# Altium project Probe.PrjPCB
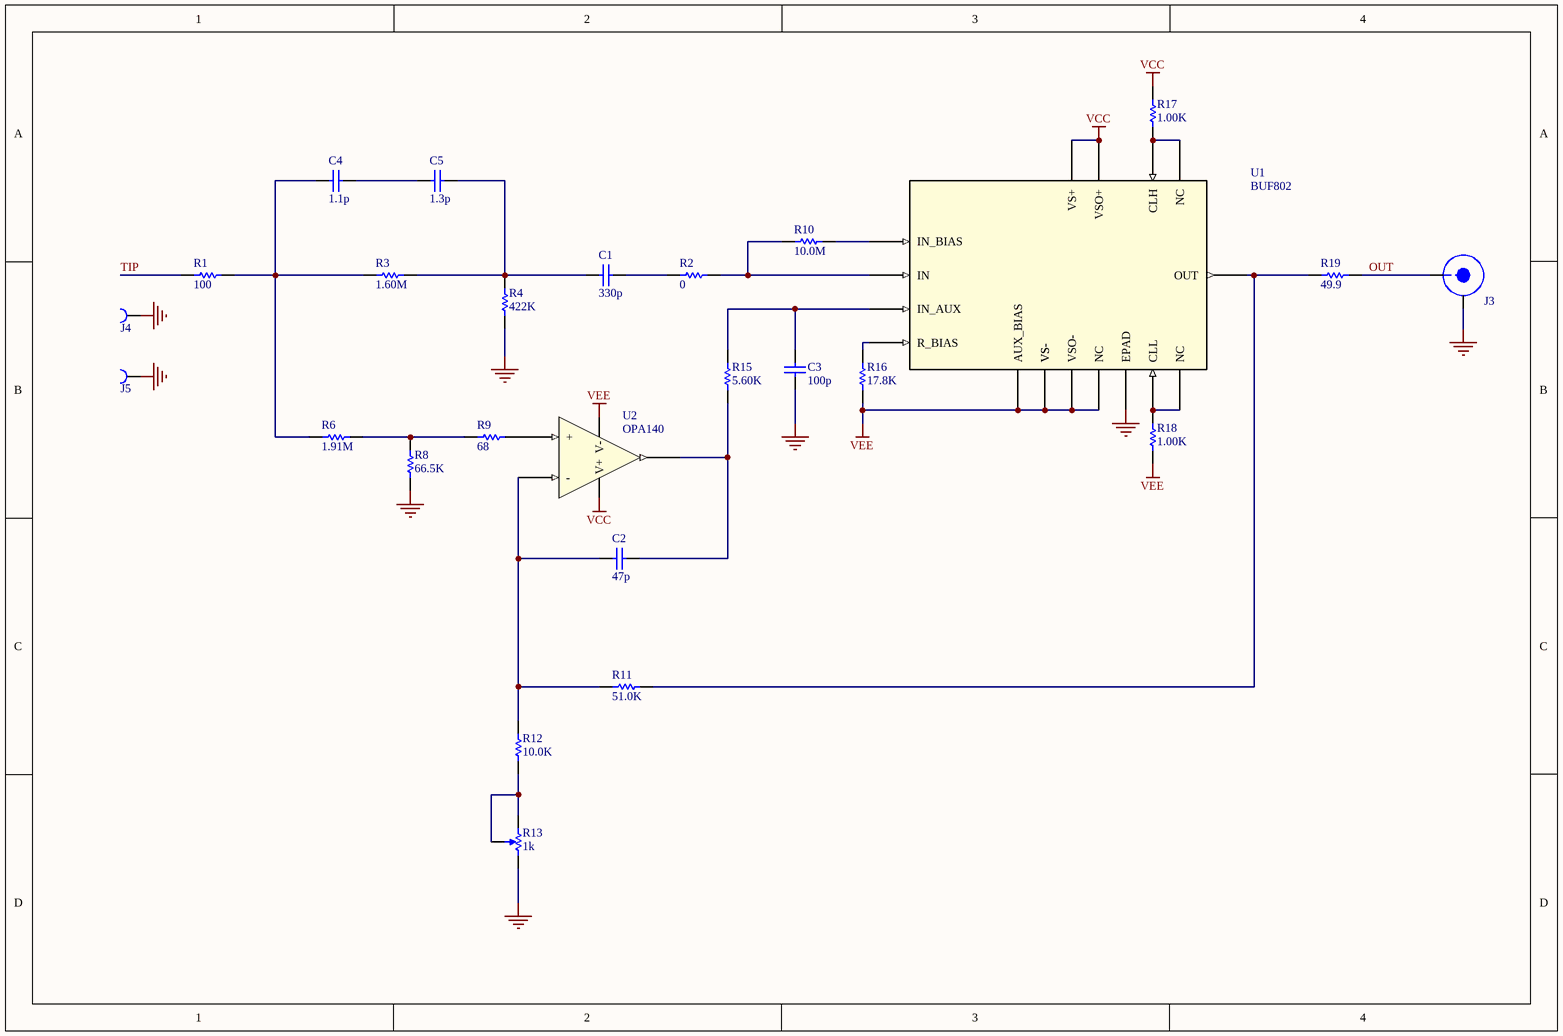
[diagram p0: Probe.SchDoc]
2 sheets, 62 parts. Net scope: global (net labels, ports and power ports of the same name join across sheets).
Board file: Probe.PcbDoc
Sheets:
  Probe.SchDoc
  Power.SchDoc

## Sheet Probe.SchDoc: Active probe evaluation board
size A4

### Parts
C1  330p  [CAPC0402(1005)50_M]
C2  47p  [CAPC0402(1005)50_M]
C3  100p  [CAPC0402(1005)50_M]
C4  1.1p  [CAPC0402(1005)50_M]
C5  1.3p  [CAPC0402(1005)50_M]
J3  BWSMA-KE-P001  [BATWIRELESS_BWSMA-KE-P001]  (value not drawn)
J4  0339-0-15-01-15-27-10-0  [MILL-MAX 0339]  (value not drawn)
J5  0339-0-15-01-15-27-10-0  [MILL-MAX 0339]  (value not drawn)
R1  100  [RESC0402(1005)_M]
R2  0  [RESC0402(1005)_M]
R3  1.60M  [RESC0402(1005)_M]
R4  422K  [RESC0402(1005)_M]
R6  1.91M  [RESC0402(1005)_M]
R8  66.5K  [RESC0402(1005)_M]
R9  68  [RESC0402(1005)_M]
R10  10.0M  [RESC0402(1005)_M]
R11  51.0K  [RESC0402(1005)_M]
R12  10.0K  [RESC0402(1005)_M]
R13  1k  [PVG3A]
R15  5.60K  [RESC0402(1005)_M]
R16  17.8K  [RESC0402(1005)_M]
R17  1.00K  [RESC0402(1005)_M]
R18  1.00K  [RESC0402(1005)_M]
R19  49.9  [RESC0402(1005)_M]
U1  BUF802  [VQFN16_RGT_TEX- OSHPARK]
U2  OPA140  [SOIC-8]

### Nets
GND: C3.2 J3.2 J4.1 J5.1 R4.2 R8.2 R13.3 U1.17(EPAD)
VCC: R17.2 U1.1(VS+) U1.12(VSO+) U2.7(V+)
VEE: R16.2 R18.2 U1.5(VS-) U1.6(AUX_BIAS) U1.8(VS-) U1.9(NC) U1.10(VSO-) U2.4(V-)
OUT: J3.1 R19.2
TIP: R1.1
NetC1_1: C1.1 C5.2 R3.2 R4.1
NetC1_2: C1.2 R2.1
NetC2_1: C2.1 R11.1 R12.1 U2.2(-)
NetC2_2: C2.2 R15.2 U2.6(OUT)
NetC3_1: C3.1 R15.1 U1.4(IN_AUX)
NetC4_1: C4.1 R1.2 R3.1 R6.1
NetC4_2: C4.2 C5.1
NetR2_2: R2.2 R10.1 U1.2(IN)
NetR6_2: R6.2 R8.1 R9.1
NetR9_2: R9.2 U2.3(+)
NetR10_2: R10.2 U1.3(IN_BIAS)
NetR11_2: R11.2 R19.1 U1.11(OUT)
NetR12_2: R12.2 R13.1 R13.2
NetR16_1: R16.1 U1.7(R_BIAS)
NetR17_1: R17.1 U1.15(CLH) U1.16(NC)
NetR18_1: R18.1 U1.13(NC) U1.14(CLL)

### Notes on the sheet
- Title
- Size:
- Date:
- A4
- Number:
- Time:
- Revision:
- Sheet
- of
- File:

### Library data of the parts
C1 = GRM1555C1H331JA01: CAP CER 330PF±5% 50V C0G 0402; Manufacturer: Murata; Manufacturer Part Number: GRM1555C1H331JA01D; Capacitance: 330pF; Tolerance: ±5%; Value: 330p; Temperature Coefficient: C0G; Part Number: GRM1555C1H331JA01
C2 = CL05C470JB5NNN: CAP CER 47PF±5% 50V C0G 0402; Manufacturer: Samsung Electro-Mechanics; Manufacturer Part Number: CL05C470JB5NNNC; Capacitance: 47pF; Tolerance: ±5%; Voltage Rating: 50V; Temperature Coefficient: C0G; Part Number: CL05C470JB5NNN; Value: 47p
C3 = CL05C101JB5NNN: CAP CER 100PF±5% 50V C0G 0402; Manufacturer: Samsung Electro-Mechanics; Manufacturer Part Number: CL05C101JB5NNNC; Capacitance: 100pF; Tolerance: ±5%; Voltage Rating: 50V; Temperature Coefficient: C0G; Part Number: CL05C101JB5NNN; Value: 100p
C4 = GJM1555C1H1R1WB01: CAP CER 1.1PF±0.05PF 50V C0G/NP0 0402; Manufacturer: Murata; Manufacturer Part Number: GJM1555C1H1R1WB01D; Capacitance: 1.1pF; Tolerance: ±0.05pF; Temperature Coefficient: C0G; Part Number: GJM1555C1H1R1WB01; Value: 1.1p
C5 = GJM1555C1H1R3WB01: CAP CER 1.3PF±0.05PF 50V C0G/NP0 0402; Manufacturer: Murata; Manufacturer Part Number: GJM1555C1H1R3WB01D; Capacitance: 1.3pF; Tolerance: ±0.05pF; Temperature Coefficient: C0G; Part Number: GJM1555C1H1R3WB01; Value: 1.3p
J3 = 901-10511-3: CONN SMA JACK STR 50OHM EDGE MNT; Manufacturer: BAT WIRELESS; Impedance: 50R; Max Frequency: 26.5GHz; Voltage Rating: 170V; Supplier 1: Digi-Key; Manufacturer PartN: BWSMA-KE-P001; Case/Package: SMA; Contact Material: Copper; Min Operating Temperature: -65°C; Max Operating Temperature: 165°C; Connector Type: SMA; Series: -; Packaging: Bulk; Termination: Solder; ComponentLink1URL: https://datasheet.octopart.com/901-10511-3-Amphenol-RF-datasheet-67291285.pdf?src-supplier=Element14; ComponentLink1Description: https://datasheet.octopart.com/901-10511-3-Amphenol-RF-datasheet-67291285.pdf?src-supplier=Element14; Supplier 2: Mouser; Supplier Part Number 2: 523-901-10511-3; Supplier Part Number 1: ARF2500-ND; Mount: Edge,Board; RoHS Compliant: Yes; ComponentLink2URL: https://datasheet.octopart.com/901-10511-3-Amphenol-RF-datasheet-67291280.pdf?src-supplier=Newark; ComponentLink2Description: https://datasheet.octopart.com/901-10511-3-Amphenol-RF-datasheet-67291280.pdf?src-supplier=Newark; ComponentLink3URL: http://www.amphenolrf.com/media/downloads/7776/C901-10511-3.pdf?src-supplier=Digi-Key; ComponentLink3Description: http://www.amphenolrf.com/media/downloads/7776/C901-10511-3.pdf?src-supplier=Digi-Key; Distributor: LCSC; Distributor PartN: C496550
J4 J5 = 0339-0-15-01-15-27-10-0: CONN PIN RCPT; Manufacturer: TE Connectivity; Manufacturer PartN: 50935-6; Parameters: Spring Socket; Value: 50935-6; Distributor: LCSC; Distributor PartN: C5439457
R1 = RESC0402-100R-1pct: RES 100 OHM 1% 1/16W 0402; Manufacturer 1: Yageo; Manufacturer Part Number 1: RC0402FR-07100RL; Part Number: RESC0402-100R-1pct; Ohms: 100; Value: 100; Manufacturer 2: Stackpole Electronics; Manufacturer Part Number 2: RMCF0402FT100R; Manufacturer 3: Vishay Dale; Manufacturer Part Number 3: CRCW0402100RFKED; Manufacturer 4: Panasonic Electronic Components; Manufacturer Part Number 4: ERJ-2RKF1000X
R2 = R0402-0R0-JMP: RES 0 OHM JUMPER 0402; Manufacturer 1: Yageo; Manufacturer Part Number 1: RC0402FR-071RL; Part Number: R0402-0R0-JMP; Ohms: 0; Value: 0; Manufacturer 2: Stackpole Electronics; Manufacturer Part Number 2: RMCF0402FT1R00; Manufacturer 3: Vishay Dale; Manufacturer Part Number 3: CRCW04021R00FNED; Manufacturer 4: Panasonic Electronic Components; Manufacturer Part Number 4: ERJ-2GE0R00X
R3 = RESC0402-1M60-1pct: RES 1.60M OHM 1% 1/16W 0402; Manufacturer 1: Yageo; Manufacturer Part Number 1: RC0402FR-071M6L; Ohms: 1600000; Part Number: RESC0402-1M60-1pct; Value: 1.60M; Manufacturer 2: Stackpole Electronics; Manufacturer Part Number 2: RMCF0402FT1M60; Manufacturer 3: Vishay Dale; Manufacturer Part Number 3: CRCW04021M60FKED; Manufacturer 4: Panasonic Electronic Components
R4 = RESC0402-422K-1pct: RES 422K OHM 1% 1/16W 0402; Manufacturer 1: Yageo; Manufacturer Part Number 1: RC0402FR-07422KL; Ohms: 422000; Part Number: RESC0402-422K-1pct; Value: 422K; Manufacturer 2: Stackpole Electronics; Manufacturer Part Number 2: RMCF0402FT422K; Manufacturer 3: Vishay Dale; Manufacturer Part Number 3: CRCW0402422KFKED; Manufacturer 4: Panasonic Electronic Components; Manufacturer Part Number 4: ERJ-2RKF4223X
R6 = RESC0402-1M91-1pct: RES 1.91M OHM 1% 1/16W 0402; Manufacturer 1: Yageo; Manufacturer Part Number 1: RC0402FR-071M91L; Ohms: 1910000; Part Number: RESC0402-1M91-1pct; Value: 1.91M; Manufacturer 2: Stackpole Electronics; Manufacturer Part Number 2: RMCF0402FT1M91; Manufacturer 3: Vishay Dale; Manufacturer Part Number 3: CRCW04021M91FKED; Manufacturer 4: Panasonic Electronic Components
R8 = RESC0402-66K5-1pct: RES 66.5K OHM 1% 1/16W 0402; Manufacturer 1: Yageo; Manufacturer Part Number 1: RC0402FR-0766K5L; Ohms: 66500; Part Number: RESC0402-66K5-1pct; Value: 66.5K; Manufacturer 2: Stackpole Electronics; Manufacturer Part Number 2: RMCF0402FT66K5; Manufacturer 3: Vishay Dale; Manufacturer Part Number 3: CRCW040266K5FKED; Manufacturer 4: Panasonic Electronic Components; Manufacturer Part Number 4: ERJ-2RKF6652X
R9 = RESC0402-68R0-1pct: RES 68 OHM 1% 1/16W 0402; Manufacturer 1: Yageo; Manufacturer Part Number 1: RC0402FR-0768RL; Part Number: RESC0402-68R0-1pct; Ohms: 68; Value: 68; Manufacturer 2: Stackpole Electronics; Manufacturer Part Number 2: RMCF0402FT68R0; Manufacturer 3: Vishay Dale; Manufacturer Part Number 3: CRCW040268R0FKED; Manufacturer 4: Panasonic Electronic Components; Manufacturer Part Number 4: ERJ-2RKF68R0X
R10 = RESC0402-10M0-1pct: RES 10.0M OHM 1% 1/16W 0402; Manufacturer 1: Yageo; Manufacturer Part Number 1: RC0402FR-0710ML; Ohms: 10000000; Part Number: RESC0402-10M0-1pct; Value: 10.0M; Manufacturer 2: Stackpole Electronics; Manufacturer Part Number 2: RMCF0402FT10M0; Manufacturer 3: Vishay Dale; Manufacturer Part Number 3: CRCW040210M0FKED; Manufacturer 4: Panasonic Electronic Components
R11 = RESC0402-51K0-1pct: RES 51.0K OHM 1% 1/16W 0402; Manufacturer 1: Yageo; Manufacturer Part Number 1: RC0402FR-0751KL; Ohms: 51000; Part Number: RESC0402-51K0-1pct; Value: 51.0K; Manufacturer 2: Stackpole Electronics; Manufacturer Part Number 2: RMCF0402FT51K0; Manufacturer 3: Vishay Dale; Manufacturer Part Number 3: CRCW040251K0FKED; Manufacturer 4: Panasonic Electronic Components; Manufacturer Part Number 4: ERJ-2RKF5102X
R12 = RESC0402-10K0-1pct: RES 10.0K OHM 1% 1/16W 0402; Manufacturer 1: Yageo; Manufacturer Part Number 1: RC0402FR-0710KL; Ohms: 10000; Part Number: RESC0402-10K0-1pct; Value: 10.0K; Manufacturer 2: Stackpole Electronics; Manufacturer Part Number 2: RMCF0402FT10K0; Manufacturer 3: Vishay Dale; Manufacturer Part Number 3: CRCW040210K0FKED; Manufacturer 4: Panasonic Electronic Components; Manufacturer Part Number 4: ERJ-2RKF1002X
R13 = PVG3A102C01R00: TRIMMER 1K OHM 0.25W J LEAD TOP; Manufacturer: Bourns; Resistance: 1kR; Number of Turns: 1; Max Power Dissipation: 250mW; Tolerance: 20%; Temperature Coefficient: 150ppm/°C; Supplier 1: Digi-Key; Supplier Part Number 1: 490-2643-6-ND; Manufacturer Part Number: PVG3A102C01R00; Stock 1: 4867; Pricing 1: 1=1.44, 10=1.273, 25=1.1452, 50=1.103, 100=1.0605, 250=0.99688, 500=0.8484 (USD); Mount: Surface Mount; Packaging: Cut Tape; Resistor Type: Cermet; Height: 0.079inch; ComponentLink1URL: https://datasheet.octopart.com/PVG3A102C01R00-Bourns-datasheet-154729832.pdf?src-supplier=Newark; ComponentLink1Description: https://datasheet.octopart.com/PVG3A102C01R00-Bourns-datasheet-154729832.pdf?src-supplier=Newark; ComponentLink2URL: https://datasheet.octopart.com/PVG3A102C01R00-Bourns-datasheet-82548162.pdf?src-supplier=Element14; ComponentLink2Description: https://datasheet.octopart.com/PVG3A102C01R00-Bourns-datasheet-82548162.pdf?src-supplier=Element14; ComponentLink3URL: https://www.bourns.com/docs/Product-Datasheets/pvg3.pdf?src-supplier=Digi-Key; ComponentLink3Description: https://www.bourns.com/docs/Product-Datasheets/pvg3.pdf?src-supplier=Digi-Key; ComponentLink4URL: http://www.bourns.com/docs/Product-Datasheets/pvg3.pdf?src-supplier=Digi-Key; ComponentLink4Description: http://www.bourns.com/docs/Product-Datasheets/pvg3.pdf?src-supplier=Digi-Key; ComponentLink5URL: https://www.mouser.com/ds/2/54/vg3-1084610.pdf?src-supplier=Mouser; ComponentLink5Description: https://www.mouser.com/ds/2/54/vg3-1084610.pdf?src-supplier=Mouser; Supplier 2: Mouser; Supplier Part Number 2: 81-PVG3A102C01R00
R15 = RESC0402-5K60-1pct: RES 5.60K OHM 1% 1/16W 0402; Manufacturer 1: Yageo; Manufacturer Part Number 1: RC0402FR-075K6L; Ohms: 5600; Part Number: RESC0402-5K60-1pct; Value: 5.60K; Manufacturer 2: Stackpole Electronics; Manufacturer Part Number 2: RMCF0402FT5K60; Manufacturer 3: Vishay Dale; Manufacturer Part Number 3: CRCW04025K60FKED; Manufacturer 4: Panasonic Electronic Components; Manufacturer Part Number 4: ERJ-2RKF5601X
R16 = RESC0402-17K8-1pct: RES 17.8K OHM 1% 1/16W 0402; Manufacturer 1: Yageo; Manufacturer Part Number 1: RC0402FR-0717K8L; Ohms: 17800; Part Number: RESC0402-17K8-1pct; Value: 17.8K; Manufacturer 2: Stackpole Electronics; Manufacturer Part Number 2: RMCF0402FT17K8; Manufacturer 3: Vishay Dale; Manufacturer Part Number 3: CRCW040217K8FKED; Manufacturer 4: Panasonic Electronic Components; Manufacturer Part Number 4: ERJ-2RKF1782X
R17 R18 = RESC0402-1K00-1pct: RES 1.00K OHM 1% 1/16W 0402; Manufacturer 1: Yageo; Manufacturer Part Number 1: RC0402FR-071KL; Ohms: 1000; Part Number: RESC0402-1K00-1pct; Value: 1.00K; Manufacturer 2: Stackpole Electronics; Manufacturer Part Number 2: RMCF0402FT1K00; Manufacturer 3: Vishay Dale; Manufacturer Part Number 3: CRCW04021K00FKED; Manufacturer 4: Panasonic Electronic Components; Manufacturer Part Number 4: ERJ-2RKF1001X
R19 = RESC0402-49R9-1pct: RES 49.9 OHM 1% 1/16W 0402; Manufacturer 1: Yageo; Manufacturer Part Number 1: RC0402FR-0749R9L; Part Number: RESC0402-49R9-1pct; Ohms: 49.9; Value: 49.9; Manufacturer 2: Stackpole Electronics; Manufacturer Part Number 2: RMCF0402FT49R9; Manufacturer 3: Vishay Dale; Manufacturer Part Number 3: CRCW040249R9FKED; Manufacturer 4: Panasonic Electronic Components; Manufacturer Part Number 4: ERJ-2RKF49R9X
U1 = BUF802IRGTR: WIDE-BANDWIDTH JFET BUFFER; Manufacturer: Texas Instruments; Supplier 1: Digi-Key; Manufacturer Part Number: BUF802IRGTR; Stock 1: 1253; Pricing 1: 1=5.06, 10=4.541, 25=4.2928, 100=3.7206, 250=3.5298, 500=3.16728, 1000=2.88 (USD); Supplier 2: Mouser; Supplier Part Number 1: 296-BUF802IRGTRCT-ND; Supplier Part Number 2: 595-BUF802IRGTR
U2 = OPA140AIDR: IC OPAMP JFET 1 CIRCUIT 8SOIC; Manufacturer: Texas Instruments; Slew Rate: 20V/µs; Output Current per Channel: 36mA; Number of Circuits: 1; Gain Bandwidth Product: 11MHz; Input Bias Current: 10pA; Input Offset Voltage (Vos): 30uV; Operating Supply Current: 1.8mA; Min Dual Supply Voltage: 2.25V; Max Dual Supply Voltage: 18V; Max Supply Voltage: 36V; Min Supply Voltage: 4.5V; Nominal Supply Current: 2mA; Voltage Gain: 126dB; Max I/O Voltage: 120uV; Power Supply Rejection Ratio (PSRR): 140dB; Supplier 1: Digi-Key; Manufacturer Part Number: OPA140AIDR; Stock 1: 3434; Pricing 1: 1=4.01, 10=3.606, 25=3.4088, 100=2.9542, 250=2.80276, 500=2.5149, 1000=2.121 (USD); Number of Pins: 8; Min Operating Temperature: -40°C; Max Operating Temperature: 125°C; Series: -; Packaging: Tape and Reel; RoHS Compliant: Yes; ComponentLink1URL: https://datasheet.ciiva.com/14459/sbos498a-14459066.pdf?src-supplier=Avnet; ComponentLink1Description: https://datasheet.ciiva.com/14459/sbos498a-14459066.pdf?src-supplier=Avnet; Supplier 2: Mouser; Supplier Part Number 1: 296-43606-6-ND; Supplier Part Number 2: 595-OPA140AIDR; Case/Package: D; Contact Plating: Gold; Package Quantity: 2500; Number of Elements: 1; Output Current: 36mA; Unity Gain Bandwidth Product: 11MHz; Common Mode Rejection Ratio: 126dB; Nominal Gain Bandwidth Product: 11MHz; Number of Channels: 1; Operating Supply Voltage: 18V; Supply Current: 2mA; Technology: BIFET; Radiation Hardening: No; Lead Free: Lead Free; ComponentLink2URL: https://datasheet.ciiva.com/1815/opa140-1815515.pdf?src-supplier=Digi-Key; ComponentLink2Description: https://datasheet.ciiva.com/1815/opa140-1815515.pdf?src-supplier=Digi-Key

## Sheet Power.SchDoc
size A4
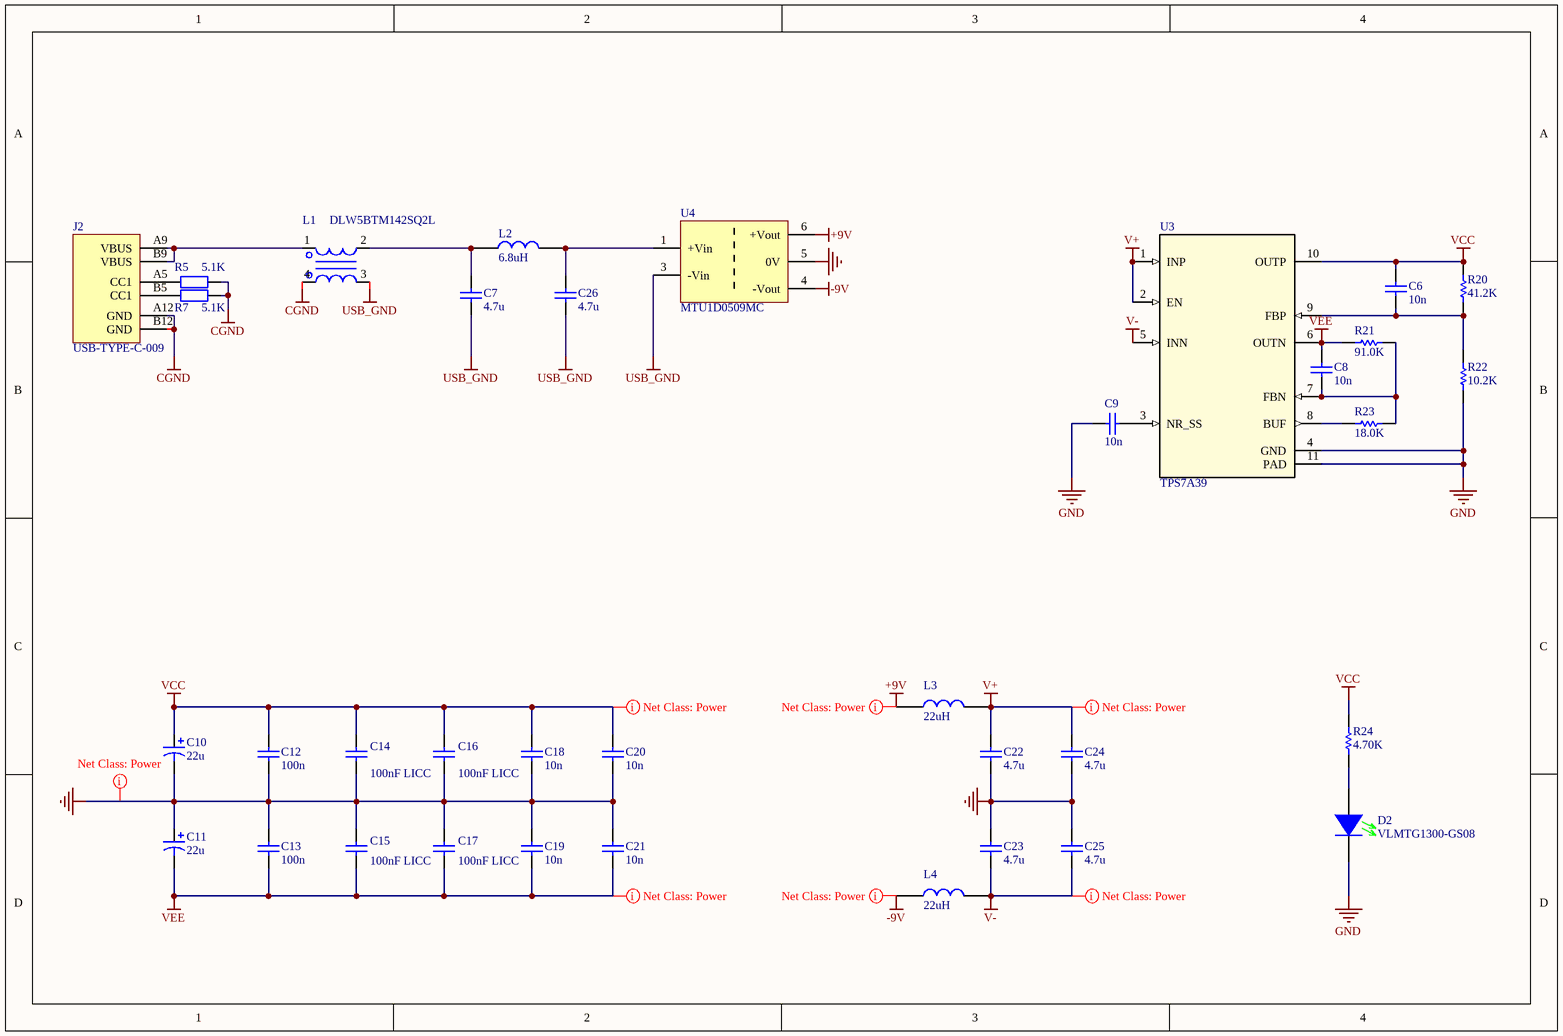
[diagram p1: Power.SchDoc]

### Parts
C6  10n  [CAPC0402(1005)50_M]
C7  4.7u  [CAPC0805(2012)100_M]
C8  10n  [CAPC0402(1005)50_M]
C9  10n  [CAPC0402(1005)50_M]
C10  22u  [KEMET B_M]
C11  22u  [KEMET B_M]
C12  100n  [CAPC0603(1608)100_M]
C13  100n  [CAPC0603(1608)100_M]
C14  value 100nF LICC  [CAPC0306_M]  (hidden comment: 100n LICC)
C15  value 100nF LICC  [CAPC0306_M]  (hidden comment: 100n LICC)
C16  value 100nF LICC  [CAPC0306_M]  (hidden comment: 100n LICC)
C17  value 100nF LICC  [CAPC0306_M]  (hidden comment: 100n LICC)
C18  10n  [CAPC0402(1005)50_M]
C19  10n  [CAPC0402(1005)50_M]
C20  10n  [CAPC0402(1005)50_M]
C21  10n  [CAPC0402(1005)50_M]
C22  4.7u  [CAPC0805(2012)100_M]
C23  4.7u  [CAPC0805(2012)100_M]
C24  4.7u  [CAPC0805(2012)100_M]
C25  4.7u  [CAPC0805(2012)100_M]
C26  4.7u  [CAPC0805(2012)100_M]
D2  VLMTG1300-GS08  [LED0603(1608)_M]
J2  value USB-TYPE-C-009  [GCT_USB4125-GF-A_REVA2]  (hidden comment: USB- C)
L1  value DLW5BTM142SQ2L  [SDCW3225]  (hidden comment: Choke)
L2  value 6.8uH  [SML-1210]  (hidden comment: Inductor)
L3  value 22uH  [SML-1210]  (hidden comment: Inductor)
L4  value 22uH  [SML-1210]  (hidden comment: Inductor)
R5  value 5.1K  [SMR-0402]  (hidden comment: Res)
R7  value 5.1K  [SMR-0402]  (hidden comment: Res)
R20  41.2K  [RESC0402(1005)_M]
R21  91.0K  [RESC0402(1005)_M]
R22  10.2K  [RESC0402(1005)_M]
R23  18.0K  [RESC0402(1005)_M]
R24  4.70K  [RESC0603(1608)_M]
U3  TPS7A39  [DSC0010J_NV]
U4  MTU1D0509MC  [MTU1D0509MC]

### Nets
+9V: L3.1 U4.6(+Vout)
-9V: L4.1 U4.4(-Vout)
CGND: J2.A12(GND) J2.B12(GND) L1.4 R5.1 R7.1
GND: C9.2 C10.2 C11.1 C12.2 C13.1 C14.2 C15.1 C16.2 C17.1 C18.2 C19.1 C20.2 C21.1 C22.2 C23.1 C24.2 C25.2 D2.2(K) R22.2 U3.4(GND) U3.11(PAD) U4.5(0V)
USB_GND: C7.2 C26.2 L1.3 U4.3(-Vin)
V+: C22.1 C24.1 L3.2 U3.1(INP) U3.2(EN)
V-: C23.2 C25.1 L4.2 U3.5(INN)
VCC: C6.2 C10.1 C12.1 C14.1 C16.1 C18.1 C20.1 R20.1 R24.1 U3.10(OUTP)
VEE: C8.2 C11.2 C13.2 C15.2 C17.2 C19.2 C21.2 R21.2 U3.6(OUTN)
NetC6_1: C6.1 R20.2 R22.1 U3.9(FBP)
NetC7_1: C7.1 L1.2 L2.1
NetC8_1: C8.1 R21.1 R23.1 U3.7(FBN)
NetC9_1: C9.1 U3.3(NR_SS)
NetC26_1: C26.1 L2.2 U4.1(+Vin)
NetD2_1: D2.1(A) R24.2
NetJ2_A5: J2.A5(CC1) R5.2
NetJ2_A9: J2.A9(VBUS) J2.B9(VBUS) L1.1
NetJ2_B5: J2.B5(CC1) R7.2
NetR23_2: R23.2 U3.8(BUF)

### Layout directives
net class Power: +9V, -9V, GND, V+, V-, VCC, VEE

### Library data of the parts
C6 C8 C9 = GRM1555C1E103JE01: CAP CER 10NF±5% 25V C0G 0402; Manufacturer: Murata; Manufacturer Part Number: GRM1555C1E103JE01D; Tolerance: ±5%; Capacitance: 10nF; Part Number: GRM1555C1E103JE01; Value: 10n; Temperature Coefficient: C0G
C7 C22-C26 = GRM21BZ71H475KE15K: CAP CER 4.7UF 50V X7R 0805; Manufacturer: Murata; Supplier 1: Digi-Key; Manufacturer Part Number: GRM21BZ71H475KE15K; Stock 1: 134344; Pricing 1: 1=0.6, 10=0.444, 50=0.3554, 100=0.3047, 500=0.2412, 1000=0.20311, 2500=0.19042, 5000=0.17772 (USD); ComponentLink1URL: https://datasheet.octopart.com/GRM21BZ71H475KE15K-Murata-datasheet-149523520.pdf?src-supplier=Newark; ComponentLink1Description: https://datasheet.octopart.com/GRM21BZ71H475KE15K-Murata-datasheet-149523520.pdf?src-supplier=Newark; Supplier Part Number 1: 490-GRM21BZ71H475KE15KCT-ND; RoHS Compliant: Yes; ComponentLink2URL: https://datasheet.octopart.com/GRM21BZ71H475KE15K-Murata-datasheet-165579666.pdf?src-supplier=TME; ComponentLink2Description: https://datasheet.octopart.com/GRM21BZ71H475KE15K-Murata-datasheet-165579666.pdf?src-supplier=TME; Supplier 2: Mouser; Supplier Part Number 2: 81-GRM21BZ71H475KE5K
C10 C11 = T491B226K016AT: CAP TANT 22UF 10% 16V 1411; Manufacturer: KEMET; Dielectric Material: Tantalum; ESR (Equivalent Series Resistance): 2.2R; Polarity: Polar; Dissipation Factor: 6%; Life (Hours): 2000Hour; Leakage Current: 3.6uA; Ripple Current: 197mA; Supplier 1: Digikey; Supplier Part Number 1: 399-8312-6-ND; Manufacturer Part Number: T491B226K016AT; Stock 1: 3174; Pricing 1: 1=0.64, 10=0.433, 50=0.3444, 100=0.2844, 500=0.2222, 1000=0.18887 (USD); Mount: Surface Mount,PCB; Case/Package: 1411; Case Code (Imperial): 1411; Case Code (Metric): 3528; Min Operating Temperature: -55°C; Max Operating Temperature: 125°C; Capacitance: 22uF; Tolerance: 10%; Packaging: Tape and Reel; Construction: Flat; Voltage Rating: 16V; Series: T491; Termination: SMD/SMT; Package Quantity: 1; Voltage Rating (DC): 16V; Features: General Purpose; Voltage: 16V; Length: 3.5mm; Width: 2.8mm; Height: 1.9mm; Depth: 2.8mm; Height - Seated (Max): 0.083inch; Radiation Hardening: No; RoHS Compliant: Yes; Lead Free: Lead Free; Reach SVHC Compliant: Yes; ComponentLink1URL: https://datasheet.ciiva.com/8079/kem-t2005-t491-8079799.pdf?src-supplier=Element14; ComponentLink1Description: https://datasheet.ciiva.com/8079/kem-t2005-t491-8079799.pdf?src-supplier=Element14; ComponentLink2URL: https://datasheet.ciiva.com/7696/1854511-7696325.pdf?src-supplier=Element14; ComponentLink2Description: https://datasheet.ciiva.com/7696/1854511-7696325.pdf?src-supplier=Element14; ComponentLink3URL: https://datasheet.ciiva.com/7696/1446014-7696326.pdf?src-supplier=Element14; ComponentLink3Description: https://datasheet.ciiva.com/7696/1446014-7696326.pdf?src-supplier=Element14; ComponentLink4URL: https://datasheet.ciiva.com/5934/1446014-5934574.pdf?src-supplier=Farnell; ComponentLink4Description: https://datasheet.ciiva.com/5934/1446014-5934574.pdf?src-supplier=Farnell; ComponentLink5URL: https://datasheet.ciiva.com/6247/kem-t2005-t491-6247978.pdf?src-supplier=Digikey; ComponentLink5Description: https://datasheet.ciiva.com/6247/kem-t2005-t491-6247978.pdf?src-supplier=Digikey; ComponentLink6URL: https://datasheet.ciiva.com/6247/kem-t2005-t491-6247977.pdf?src-supplier=Digikey; ComponentLink6Description: https://datasheet.ciiva.com/6247/kem-t2005-t491-6247977.pdf?src-supplier=Digikey; ComponentLink7URL: https://datasheet.ciiva.com/6247/kem-t2005-t491-6247979.pdf?src-supplier=Digikey; ComponentLink7Description: https://datasheet.ciiva.com/6247/kem-t2005-t491-6247979.pdf?src-supplier=Digikey; ComponentLink8URL: https://datasheet.ciiva.com/14589/70095774-14589317.pdf?src-supplier=Allied+Electronics; ComponentLink8Description: https://datasheet.ciiva.com/14589/70095774-14589317.pdf?src-supplier=Allied+Electronics; ComponentLink9URL: https://datasheet.ciiva.com/14600/70095774-14600348.pdf?src-supplier=Allied+Electronics; ComponentLink9Description: https://datasheet.ciiva.com/14600/70095774-14600348.pdf?src-supplier=Allied+Electronics; ComponentLink10URL: https://datasheet.ciiva.com/12911/kem-t2005-t491-12911727.pdf?src-supplier=Mouser; ComponentLink10Description: https://datasheet.ciiva.com/12911/kem-t2005-t491-12911727.pdf?src-supplier=Mouser; ComponentLink11URL: https://datasheet.ciiva.com/29244/458294-da-01-en-tantal-kondensator-t491b226k016at-29244581.pdf?src-supplier=Conrad; ComponentLink11Description: https://datasheet.ciiva.com/29244/458294-da-01-en-tantal-kondensator-t491b226k016at-29244581.pdf?src-supplier=Conrad; Supplier 2: Mouser; Supplier Part Number 2: 80-T491B226K016; Number of Pins: 2; Weight: 0.002293oz; Failure Rate: 0.001%; Lead Pitch: 1.9mm
C12 C13 = CC0603KRX7R9BB104: CAPACITOR CERAMIC, 0.1UF, 50V, X7R, 10%, 0603; Manufacturer: Yageo; Capacitance: 100nF; Supplier 1: Digi-Key; Manufacturer Part Number: CC0603KRX7R9BB104; Stock 1: 0; Pricing 1: 1=0.1, 10=0.066, 50=0.036, 100=0.0293, 500=0.02094, 1000=0.01646 (USD); Mount: Surface Mount; Case/Package: 0603; Number of Pins: 2; Case Code (Metric): 1608; Case Code (Imperial): 0603; Dielectric Material: Ceramic; Min Operating Temperature: -55°C; Max Operating Temperature: 125°C; Package Quantity: 1; Voltage Rating: 50V; Tolerance: 10%; Packaging: Tape and Reel; Dielectric: X7R; Termination: SMD/SMT; Voltage: 50V; Length: 1.6mm; Height: 0.8mm; Width: 0.031inch; Thickness: 0.035inch; Depth: 0.8mm; Radiation Hardening: No; REACH SVHC: No SVHC; Lead Free: Lead Free; Halogen Free: Halogen Free; ComponentLink1URL: http://www.yageo.com/documents/recent/UPY-GPHC_X7R_6.3V-to-50V_18.pdf?src-supplier=Digi-Key; ComponentLink1Description: http://www.yageo.com/documents/recent/UPY-GPHC_X7R_6.3V-to-50V_18.pdf?src-supplier=Digi-Key; ComponentLink2URL: http://www.farnell.com/datasheets/1489800.pdf?src-supplier=Element14; ComponentLink2Description: http://www.farnell.com/datasheets/1489800.pdf?src-supplier=Element14; ComponentLink3URL: http://www.yageo.com/documents/recent/UPY-GPHC_X7R_6.3V-to-50V_8.pdf?src-supplier=Avnet+Europe; ComponentLink3Description: http://www.yageo.com/documents/recent/UPY-GPHC_X7R_6.3V-to-50V_8.pdf?src-supplier=Avnet+Europe; ComponentLink4URL: http://www.farnell.com/datasheets/2167236.pdf?src-supplier=Element14; ComponentLink4Description: http://www.farnell.com/datasheets/2167236.pdf?src-supplier=Element14; ComponentLink5URL: http://www.farnell.com/datasheets/1489800.pdf?src-supplier=Farnell; ComponentLink5Description: http://www.farnell.com/datasheets/1489800.pdf?src-supplier=Farnell; Supplier 2: Mouser; Supplier Part Number 1: 311-1344-1-ND; Supplier Part Number 2: 603-CC603KRX7R9BB104; LCSC PART #: C14663
C14-C17 = TWK107B7104MVHT: CAP CER 0.1UF 25V X7R 0306; Manufacturer: YAGEO; Manufacturer PartN: CL0306KRX7R6BB104; Parameters: 100nF X7R +/-10% 0306; Distributor: LCSC; Distributor PartN: C2217498
  C15-C17: ComponentLink1URL: http://ds.yuden.co.jp/TYCOMPAS/ut/detail.do?productNo=TWK107B7104MVHT&amp;fileName=TWK107B7104MVHT_SS&amp;mode=specSheetDownload&src-supplier=Digi-Key; ComponentLink1Description: http://ds.yuden.co.jp/TYCOMPAS/ut/detail.do?productNo=TWK107B7104MVHT&amp;fileName=TWK107B7104MVHT_SS&amp;mode=specSheetDownload&src-supplier=Digi-Key; ComponentLink2URL: https://ds.yuden.co.jp/TYCOMPAS/ut/detail?pn=TWK107B7104MVHT &amp;u=M&src-supplier=Digi-Key; ComponentLink2Description: https://ds.yuden.co.jp/TYCOMPAS/ut/detail?pn=TWK107B7104MVHT &amp;u=M&src-supplier=Digi-Key
C18 = GRM155R71H103KA88: CAP CER 10NF±10% 50V X7R 0402; Manufacturer: Murata; Manufacturer PartN: GRM155R71H103KA88D; Capacitance: 10nF; Tolerance: ±10%; Part Number: GRM155R71H103KA88; Value: 10n; Temperature Coefficient: X7R
C19-C21 = GRM155R71H103KA88: CAP CER 10NF±10% 50V X7R 0402; Manufacturer: Murata; Manufacturer Part Number: GRM155R71H103KA88D; Capacitance: 10nF; Tolerance: ±10%; Part Number: GRM155R71H103KA88; Value: 10n; Temperature Coefficient: X7R
D2 = VLMTG1300-GS08: LED GREEN 0603 SMD; Manufacturer: Vishay Semiconductors; Viewing Angle: 130°; Lens Style: Rectangular,Clear; Wavelength: 525nm; Forward Voltage: 3.2V; Luminous Intensity: 450mcd; Forward Current: 20mA; Power Rating: 75mW; Number of Elements: 1; Power Dissipation: 76mW; Supplier 1: Digi-Key; Supplier Part Number 1: VLMTG1300-GS08CT-ND; Manufacturer Part Number: VLMTG1300-GS08; Stock 1: 156996; Pricing 1: 1=0.46, 10=0.305, 100=0.2033, 500=0.1406, 1000=0.11716 (USD); Mount: Surface Mount; Case/Package: 0603; Number of Pins: 2; Color: Green; Case Code (Metric): 1608; Case Code (Imperial): 0603; Contact Plating: Tin,Matte; Min Operating Temperature: -35°C; Max Operating Temperature: 85°C; Package Quantity: 1; Packaging: Tape and Reel; Illumination Color: Green; Dominant Wavelength: 525nm; Test Current: 20mA; Number of LEDs: 1; Max Power Dissipation: 76mW; Series: CHipLED; Length: 1.6mm; Width: 0.8mm; Height: 0.8mm; Depth: 0.8mm; Radiation Hardening: No; Lead Free: Lead Free; RoHS Compliant: Yes; ComponentLink1URL: https://datasheet.ciiva.com/26322/vlmo1300-26322149.pdf?src-supplier=Element14; ComponentLink1Description: https://datasheet.ciiva.com/26322/vlmo1300-26322149.pdf?src-supplier=Element14; ComponentLink2URL: https://datasheet.ciiva.com/8028/vlmo1300-8028077.pdf?src-supplier=Element14; ComponentLink2Description: https://datasheet.ciiva.com/8028/vlmo1300-8028077.pdf?src-supplier=Element14; ComponentLink3URL: https://datasheet.ciiva.com/16510/vlmo1300-16510989.pdf?src-supplier=Future+Electronics; ComponentLink3Description: https://datasheet.ciiva.com/16510/vlmo1300-16510989.pdf?src-supplier=Future+Electronics; ComponentLink4URL: https://datasheet.ciiva.com/2115/vlmo1300-2115107.pdf?src-supplier=Digi-Key; ComponentLink4Description: https://datasheet.ciiva.com/2115/vlmo1300-2115107.pdf?src-supplier=Digi-Key; ComponentLink5URL: https://datasheet.ciiva.com/2115/vlmo1300-2115108.pdf?src-supplier=Digi-Key; ComponentLink5Description: https://datasheet.ciiva.com/2115/vlmo1300-2115108.pdf?src-supplier=Digi-Key; ComponentLink6URL: https://datasheet.ciiva.com/2115/vlmo1300-2115106.pdf?src-supplier=Digi-Key; ComponentLink6Description: https://datasheet.ciiva.com/2115/vlmo1300-2115106.pdf?src-supplier=Digi-Key; Supplier 2: Mouser; Supplier Part Number 2: 78-VLMTG1300-GS08
J2 = USB- C: USB Type C 3.1 connector; Manufacturer: DEALON; Parameters: USB Type C 3.1 9 pins; Distributor: LCSC; Distributor PartN: C2927029; Manufacturer PartN: USB-TYPE-C-009; DistributorAlt PartN: N/A; DistributorAlt: N/A
L1 = Choke: Common Mode Choke Coils; Manufacturer: Murata; Parameters: Common Mode Filters 1.4K@100MHz 56mOhm; Distributor: LCSC; Distributor PartN: C91596; Manufacturer PartN: DLW5BTM142SQ2L; DistributorAlt: N/A; DistributorAlt PartN: N/A
L2 = Inductor: Manufacturer: TDK; Manufacturer PartN: NLCV32T-6R8M-EF; Parameters: FIXED IND 6.8uH +/-20% 270mohm; Distributor: LCSC; Distributor PartN: C250230
L3 L4 = Inductor: Manufacturer: TDK; Manufacturer PartN: NLCV32T-220K-EF; Parameters: FIXED IND 22uH 1.25 Ohm; Distributor: LCSC; Distributor PartN: C250233
R5 R7 = Res: Resistor; Manufacturer: YAGEO; Price: N/A; Distributor: LCSC; Distributor PartN: C105872
R20 = RESC0402-41K2-1pct: RES 41.2K OHM 1% 1/16W 0402; Manufacturer 1: Yageo; Manufacturer Part Number 1: RC0402FR-0741K2L; Ohms: 41200; Part Number: RESC0402-41K2-1pct; Value: 41.2K; Manufacturer 2: Stackpole Electronics; Manufacturer Part Number 2: RMCF0402FT41K2; Manufacturer 3: Vishay Dale; Manufacturer Part Number 3: CRCW040241K2FKED; Manufacturer 4: Panasonic Electronic Components; Manufacturer Part Number 4: ERJ-2RKF4122X
R21 = RESC0402-91K0-1pct: RES 91.0K OHM 1% 1/16W 0402; Manufacturer 1: Yageo; Manufacturer Part Number 1: RC0402FR-0791KL; Ohms: 91000; Part Number: RESC0402-91K0-1pct; Value: 91.0K; Manufacturer 2: Stackpole Electronics; Manufacturer Part Number 2: RMCF0402FT91K0; Manufacturer 3: Vishay Dale; Manufacturer Part Number 3: CRCW040291K0FKED; Manufacturer 4: Panasonic Electronic Components; Manufacturer Part Number 4: ERJ-2RKF9102X
R22 = RESC0402-10K2-1pct: RES 10.2K OHM 1% 1/16W 0402; Manufacturer 1: Yageo; Manufacturer Part Number 1: RC0402FR-0710K2L; Ohms: 10200; Part Number: RESC0402-10K2-1pct; Value: 10.2K; Manufacturer 2: Stackpole Electronics; Manufacturer Part Number 2: RMCF0402FT10K2; Manufacturer 3: Vishay Dale; Manufacturer Part Number 3: CRCW040210K2FKED; Manufacturer 4: Panasonic Electronic Components; Manufacturer Part Number 4: ERJ-2RKF1022X
R23 = RESC0402-18K0-1pct: RES 18.0K OHM 1% 1/16W 0402; Manufacturer 1: Yageo; Manufacturer Part Number 1: RC0402FR-0718KL; Ohms: 18000; Part Number: RESC0402-18K0-1pct; Value: 18.0K; Manufacturer 2: Stackpole Electronics; Manufacturer Part Number 2: RMCF0402FT18K0; Manufacturer 3: Vishay Dale; Manufacturer Part Number 3: CRCW040218K0FKED; Manufacturer 4: Panasonic Electronic Components; Manufacturer Part Number 4: ERJ-2RKF1802X
R24 = RESC0603-4K70-1pct: RES 4.70K OHM 1% 1/10W 0603; Manufacturer 1: Yageo; Manufacturer Part Number 1: RC0603FR-074K7L; Ohms: 4700; Part Number: RESC0603-4K70-1pct; Value: 4.70K; Manufacturer 2: Stackpole Electronics; Manufacturer Part Number 2: RMCF0603FT4K70; Manufacturer 3: Vishay Dale; Manufacturer Part Number 3: CRCW06034K70FKEA; Manufacturer 4: Panasonic Electronic Components; Manufacturer Part Number 4: ERJ-3EKF4701V
U3 = TPS7A3901DSCR: IC REG LINEAR POS/NEG ADJ 10WSON; Mfr_Name: Texas Instruments; Output Type: Adjustable; Number of Regulators: 2; Max Input Voltage: 33V; Min Output Voltage: 0V; Max Output Voltage: -30V; Dropout Voltage: 500mV; Output Current: 150mA; Quiescent Current: 150uA; Max Supply Current: 904uA; Power Supply Rejection Ratio (PSRR): 69dB; Type: DEV; RefDes: RefDes; Copyright: Copyright (C) 2022 Ultra Librarian. All rights reserved.; Manufacturer_Part_Number: TPS7A3901DSCR; Supplier 1: Digi-Key; Manufacturer: Texas Instruments; Manufacturer Part Number: TPS7A3901DSCR; Stock 1: 0; Mount: Surface Mount; Min Operating Temperature: -40°C; Max Operating Temperature: 125°C; Packaging: Cut Tape; Series: -; ComponentLink1URL: http://www.ti.com/lit/ds/symlink/tps7a39.pdf?src-supplier=Digi-Key; ComponentLink1Description: http://www.ti.com/lit/ds/symlink/tps7a39.pdf?src-supplier=Digi-Key; ComponentLink2URL: http://www.ti.com/general/docs/suppproductinfo.tsp?distId=10&amp;gotoUrl=http%3A%2F%2Fwww.ti.com%2Flit%2Fgpn%2Ftps7a39&src-supplier=Digi-Key; ComponentLink2Description: http://www.ti.com/general/docs/suppproductinfo.tsp?distId=10&amp;gotoUrl=http%3A%2F%2Fwww.ti.com%2Flit%2Fgpn%2Ftps7a39&src-supplier=Digi-Key; Supplier 2: Mouser; Supplier Part Number 1: 296-TPS7A3901DSCRCT-ND; Supplier Part Number 2: 595-TPS7A3901DSCR
U4 = MTU1D0509MC: Isolated DC/DC 1W 5-> +/-9V; Manufacturer: Murata; Distributor: Digikey; Distributor PartN: 811-2376-ND; Manufacturer PartN: MTU1D0509MC; DistributorAlt PartN: N/A; DistributorAlt: N/A; Parameters: Isolated DC/DC 1W 5-> +/-9V; Value: MTU1D0509MC

## Nets that join several sheets
GND: Probe (8 pins), Power (22 pins)
VCC: Probe (R17.2 U1.1 U1.12 U2.7), Power (10 pins)
VEE: Probe (8 pins), Power (9 pins)